# Altium schematic sheet khối cảm biến và khối khuếch đại1.SchDoc
size A
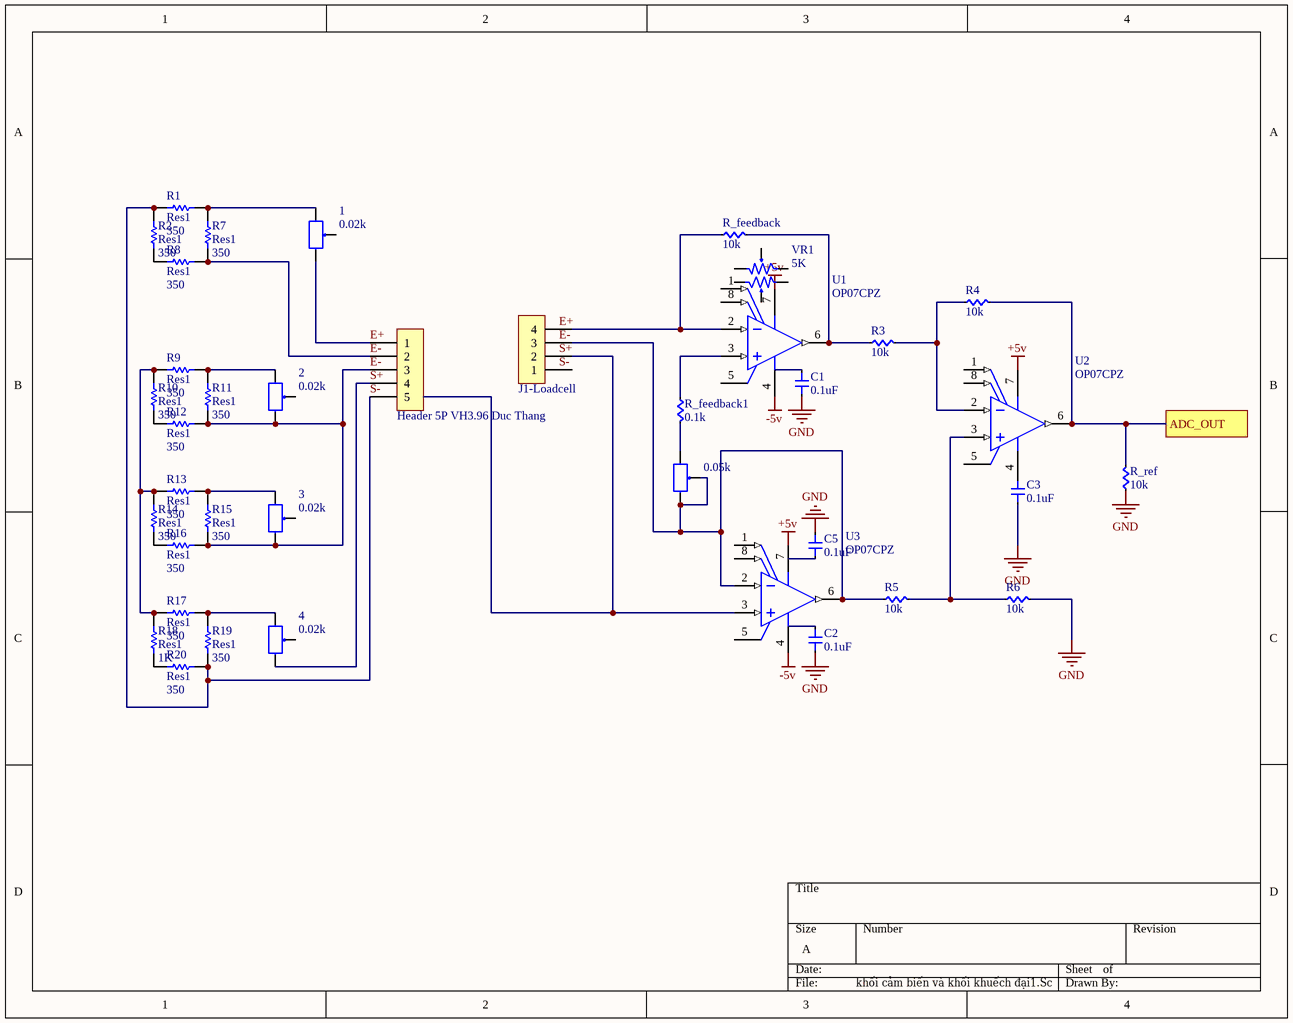
[diagram p0: khối cảm biến và khối khuếch đại1.SchDoc]

## Parts
1  0.02k  [Bien Tro Vi Chinh Dung]
2  0.02k  [Bien Tro Vi Chinh Dung]
3  0.02k  [Bien Tro Vi Chinh Dung]
4  0.02k  [Bien Tro Vi Chinh Dung]
?  0.05k  [Bien Tro Vi Chinh Dung]
C1  0.1uF  [Cap 0201]
C2  0.1uF  [Cap 0201]
C3  0.1uF  [Cap 0201]
C5  0.1uF  [Cap 0201]
H1  J1-Loadcell  [VH3.96M-4]
H2  Header 5P VH3.96 Duc Thang  [VH3.96M-5]
R1  Res1  value 350  [AXIAL-0.3]
R2  Res1  value 350  [AXIAL-0.3]
R3  10k  [RES 1206]
R4  10k  [RES 1206]
R5  10k  [RES 1206]
R6  10k  [RES 1206]
R7  Res1  value 350  [AXIAL-0.3]
R8  Res1  value 350  [AXIAL-0.3]
R9  Res1  value 350  [AXIAL-0.3]
R10  Res1  value 350  [AXIAL-0.3]
R11  Res1  value 350  [AXIAL-0.3]
R12  Res1  value 350  [AXIAL-0.3]
R13  Res1  value 350  [AXIAL-0.3]
R14  Res1  value 350  [AXIAL-0.3]
R15  Res1  value 350  [AXIAL-0.3]
R16  Res1  value 350  [AXIAL-0.3]
R17  Res1  value 350  [AXIAL-0.3]
R18  Res1  value 1K  [AXIAL-0.3]
R19  Res1  value 350  [AXIAL-0.3]
R20  Res1  value 350  [AXIAL-0.3]
R_feedback  10k  [RES 1206]
R_feedback1  0.1k  [RES 1206]
R_ref  10k  [RES 1206]
U1  OP07CPZ  [ADI-N-8]
U2  OP07CPZ  [ADI-N-8]
U3  OP07CPZ  [ADI-N-8]
VR1  5K  [Bien TRo Volume Doi]

## Ports
ADC_OUT

## Nets
+5v: U1.7(+V) U2.7(+V) U3.7(+V)
-5v: U1.4(-V) U3.4(-V)
GND: C1.2 C2.2 C3.2 C5.1 R6.2 R_ref.1
ADC_OUT: R4.2 R_ref.2 U2.6(OUT) ; port ADC_OUT
E+: 1.3 H2.1
E-: 2.3 3.3 H2.2 H2.3 R7.1 R8.2 R11.2 R12.2 R15.2 R16.2
S+: 4.3 H2.4
S-: H2.5 R1.1 R2.2 R19.2 R20.2
Net1_1: 1.1 R1.2 R7.2
Net2_1: 2.1 R9.2 R11.1
Net3_1: 3.1 R13.2 R15.1
Net4_1: 4.1 R17.2 R19.1
Net?_1: ?.1 R_feedback1.2
Net?_2: ?.2 ?.3 H1.3 R5.1 U3.2(-IN) U3.6(OUT)
NetC3_1: C3.1 U2.4(-V)
NetH1_2: H1.2 U3.3(+IN)
NetH1_4: H1.4 R_feedback.1 U1.2(-IN)
NetR2_1: R2.1 R8.1
NetR3_1: R3.1 R_feedback.2 U1.6(OUT)
NetR3_2: R3.2 R4.1 U2.2(-IN)
NetR5_2: R5.2 R6.1 U2.3(+IN)
NetR9_1: R9.1 R10.1 R13.1 R14.1 R17.1 R18.1
NetR10_2: R10.2 R12.1
NetR14_2: R14.2 R16.1
NetR18_2: R18.2 R20.1
NetR_feedback1_1: R_feedback1.1 U1.3(+IN)

Not connected (* = marked no-connect by the designer): 1 2; 2 2; 3 2; 4 2; C1 1; C2 1; C5 2; H1 1; U1 1(VOS_TRIM) 5(NC) 8(VOS_TRIM); U2 1(VOS_TRIM) 5(NC) 8(VOS_TRIM); U3 1(VOS_TRIM) 5(NC) 8(VOS_TRIM); VR1 1 2 3 4 5 6

## Notes on the sheet
- Labels drawn without touching a wire or pin: E+, E-, S+, S-

## Library data of the parts
1-4 ? = Bien Tro Tinh Chinh 100R Dung: Cắm; Don_Vi: Con; Ten_Linh_Kien: Biến Trở VR 101-100R 3296W; Ma_Hang: MH003235; Kieu_Chan: *; Chung_Loai: Cắm
C1-C3 C5 = Cap 0201: Capacitor SMD 0201
H1 = Header 4P VH3.96 Duc Thang: Cắm; Ten_Linh_Kien: Header 4P XH2.54-4P Đực Thẳng; Don_Vi: Con; Ma_Hang: MH001285; Chung_Loai: Cắm
H2 = Header 5P VH3.96 Duc Thang: Cắm; Ten_Linh_Kien: Header 5P XH2.54-5P Đực Thẳng; Don_Vi: Con; Ma_Hang: MH001298; Chung_Loai: Cắm
R1 R2 R7-R20 = Res1: Resistor; Published: 8-Jun-2000; LatestRevisionDate: 17-Jul-2002; LatestRevisionNote: Re-released for DXP Platform.; PackageReference: AXIAL-0.3; Publisher: Altium Limited; PackageDescription: Axial Device, Thru-Hole; 2 Leads; 0.3 in Pin Spacing
R3-R6 R_feedback R_ref = RES 1206: RES SMD 1206; Manufacturer: Vishay Dale; Manufacturer Part Number: CRCW040210K0FKED; Tolerance: ±1%; Power (Watts): 0.063W, 1/16W; Temperature Coefficient: ±100ppm/°C; Supplier 1: Digi-Key; RoHS: RoHS Compliant; Category: Resistors; Stock 1: 2392462; Pricing 1: 10=0.083, 50=0.0444, 200=0.0255, 1000=0.0174 (USD); Packaging: Cut Tape (CT); Resistance (Ohms): 10k; Composition: Thick Film; Features: Automotive AEC-Q200; Operating Temperature: -55°C ~ 155°C; Package / Case: 0402 (1005 Metric); Supplier Device Package: 0402 (1005 Metric); Size / Dimension: 0.039" L x 0.020" W (1.00mm x 0.50mm); Height: 0.016" (0.40mm); Number of Terminations: 2; ComponentLink1URL: http://www.vishay.com/docs/20035/dcrcwe3.pdf; ComponentLink1Description: http://www.vishay.com/docs/20035/dcrcwe3.pdf; Supplier Part Number 1: 541-10.0KLCT-ND
R_feedback1 = RES 1206: RES SMD 1206; Manufacturer: Vishay Dale; Manufacturer Part Number: CRCW040210K0FKED; Resistance (Ohms): 10k; Tolerance: ±1%; Power (Watts): 0.063W, 1/16W; Temperature Coefficient: ±100ppm/°C; Supplier 1: Digi-Key; RoHS: RoHS Compliant; Category: Resistors; Stock 1: 2392462; Pricing 1: 10=0.083, 50=0.0444, 200=0.0255, 1000=0.0174 (USD); Packaging: Cut Tape (CT); Composition: Thick Film; Features: Automotive AEC-Q200; Operating Temperature: -55°C ~ 155°C; Package / Case: 0402 (1005 Metric); Supplier Device Package: 0402 (1005 Metric); Size / Dimension: 0.039" L x 0.020" W (1.00mm x 0.50mm); Height: 0.016" (0.40mm); Number of Terminations: 2; ComponentLink1URL: http://www.vishay.com/docs/20035/dcrcwe3.pdf; ComponentLink1Description: http://www.vishay.com/docs/20035/dcrcwe3.pdf; Supplier Part Number 1: 541-10.0KLCT-ND
U1-U3 = CMP-0384-00212-1: Single Channel Low Noise Operational Amplifier, 600 KHz BW, 300 mV/us SR, Industrial, 8-pin DIP (N-8), Tube; Generic Part Number: OP07; Manufacturer: Analog Devices; # OpAmps per Pkg: 1; V Span Max: 44V; Small Signal Bandwidth: 600KHz; V Span Min: 6V; Mounting Technology: Through Hole; PackageVersion: 070606-A; PackageDescription: 8-Pin Plastic Dual In-Line Package, Row spacing 7.62 mm, Pitch 2.54 mm; PartNumber: OP07CPZ; PackageReference: N-8; ComponentLink3URL: http:/www.analog.com/static/imported-files/packages/PKG_PDF/PDIP(N)/N_8.pdf; Packing: Tube; ComponentLink3Description: Package Specification; ComponentLink1URL: http://www.analog.com/en/index.html; DatasheetVersion: Rev. G; ComponentLink2Description: Datasheet; Slew Rate: 300mV/us; Code_JEDEC: MS-001; ComponentLink1Description: Manufacturer URL; ComponentLink2URL: http://www.analog.com/static/imported-files/data_sheets/OP07.pdf
VR1 = Triet Ap Doi 5k: Cắm; Don_Vi: Con; Ten_Linh_Kien: Triết Áp Đôi B5K; Ma_Hang: MH001563; Kieu_Chan: *; Chung_Loai: Cắm